# EAGLE design skema rangkaian (EAGLE 9.6.2)
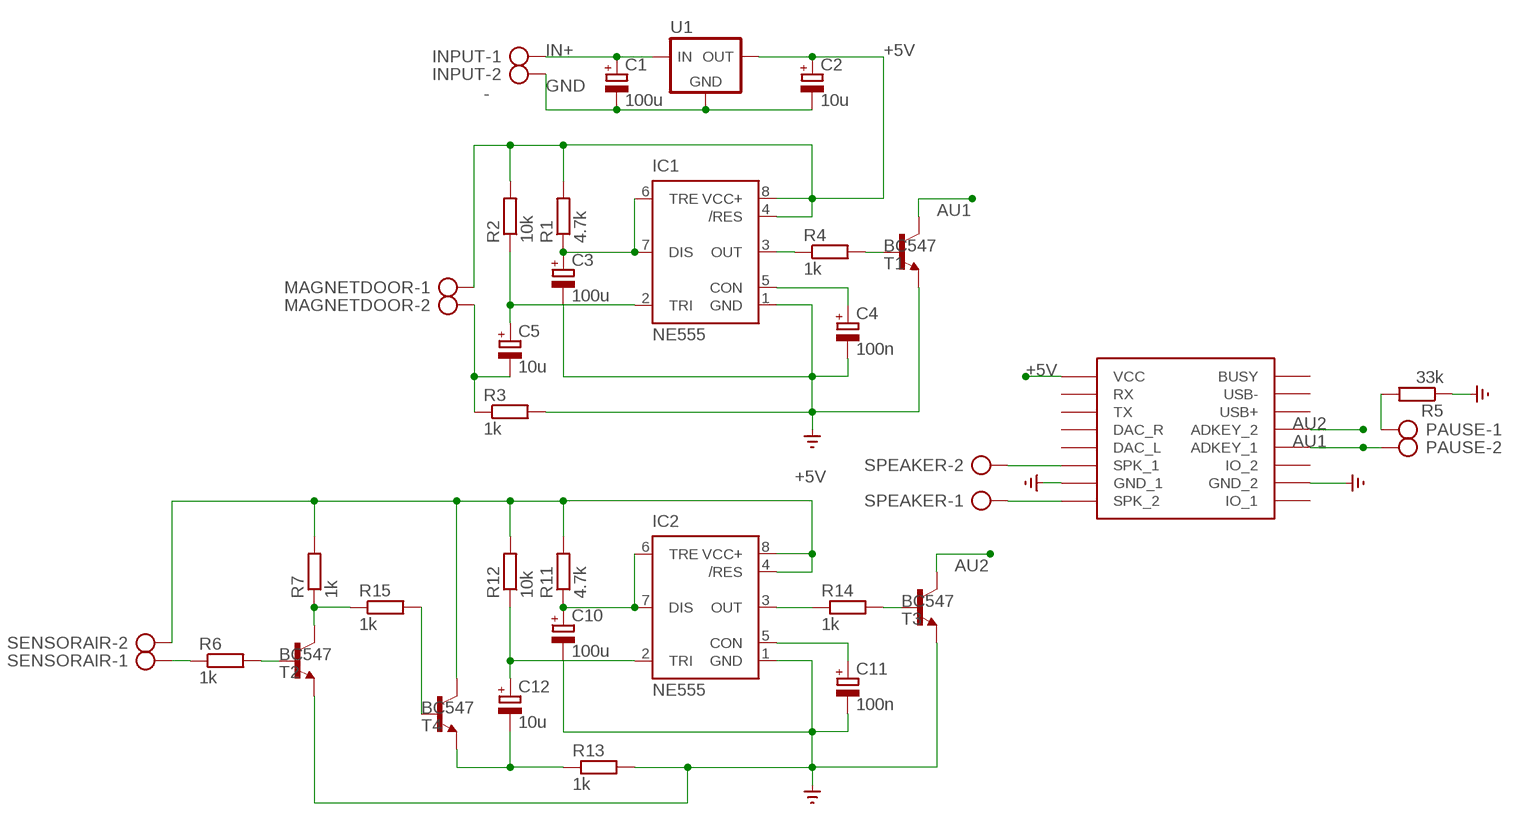
[diagram p0: schematic, sheet 1]

## Parts
C1  100u  CPOL-EUE2-5  [E2-5]
C2  10u  CPOL-EUE2-5  [E2-5]
C3  100u  CPOL-EUE2-5  [E2-5]
C4  100n  CPOL-EUE2-5  [E2-5]
C5  10u  CPOL-EUE2-5  [E2-5]
C10  100u  CPOL-EUE2-5  [E2-5]
C11  100n  CPOL-EUE2-5  [E2-5]
C12  10u  CPOL-EUE2-5  [E2-5]
IC1  NE555  [DIL-08]
IC2  NE555  [DIL-08]
INPUT  -  AK500/2-H  [AK500/2-H]
MAGNETDOOR  AK500/2-H  [AK500/2-H]
PAUSE  AK500/2-H  [AK500/2-H]
R1  4.7k  R-EU_0207/10  [0207/10]
R2  10k  R-EU_0207/10  [0207/10]
R3  1k  R-EU_0207/10  [0207/10]
R4  1k  R-EU_0207/10  [0207/10]
R5  33k  R-EU_0207/10  [0207/10]
R6  1k  R-EU_0207/10  [0207/10]
R7  1k  R-EU_0207/10  [0207/10]
R11  4.7k  R-EU_0207/10  [0207/10]
R12  10k  R-EU_0207/10  [0207/10]
R13  1k  R-EU_0207/10  [0207/10]
R14  1k  R-EU_0207/10  [0207/10]
R15  1k  R-EU_0207/10  [0207/10]
SENSORAIR  AK500/2-H  [AK500/2-H]
SPEAKER  AK500/2-H  [AK500/2-H]
T1  BC547  [TO92]
T2  BC547  [TO92]
T3  BC547  [TO92]
T4  BC547  [TO92]
U1  78XX-TO220V  [TO220BV]
U$1  DFPLAYER  [DFPLAYER]

## Nets
+5V: C2.+ IC1.4(/RES) IC1.8(VCC+) IC2.4(/RES) IC2.8(VCC+) MAGNETDOOR.1 R1.2 R2.2 R7.2 R11.2 R12.2 SENSORAIR.2 T4.3(C) U1.3(VOUT) U$1.VCC
AU1: PAUSE.2 T1.3(C) U$1.ADKEY1(ADKEY_1)
AU2: T3.3(C) U$1.ADKEY2(ADKEY_2)
GND: C1.- C2.- C3.- C4.- C10.- C11.- IC1.1(GND) IC2.1(GND) INPUT.2 R3.2 R5.1 R13.2 T1.1(E) T2.1(E) T3.1(E) U1.2(GND) U$1.GND_1 U$1.GND_2 ; supply symbol labelled SUPPLY0_GND_
IN+: C1.+ INPUT.1 U1.1(VIN)
N$1: R14.2 T3.2(B)
N$2: R6.2 T2.2(B)
N$3: C3.+ IC1.6(TRE) IC1.7(DIS) R1.1
N$4: C10.+ IC2.6(TRE) IC2.7(DIS) R11.1
N$5: C4.+ IC1.5(CON)
N$6: C5.+ IC1.2(TRI) R2.1
N$7: C5.- MAGNETDOOR.2 R3.1
N$8: IC1.3(OUT) R4.1
N$9: R4.2 T1.2(B)
N$10: PAUSE.1 R5.2
N$11: C11.+ IC2.5(CON)
N$12: C12.+ IC2.2(TRI) R12.1
N$13: C12.- R13.1 T4.1(E)
N$14: IC2.3(OUT) R14.1
N$15: SPEAKER.2 U$1.SPK1(SPK_1)
N$16: R6.1 SENSORAIR.1
N$17: R7.1 R15.1 T2.3(C)
N$18: R15.2 T4.2(B)
N$19: SPEAKER.1 U$1.SPK2(SPK_2)
Unconnected: U$1.BUSY U$1.DAC_L U$1.DAC_R U$1.IO1(IO_1) U$1.IO2(IO_2) U$1.RX U$1.TX U$1.USB+ U$1.USB-

## Library data of the parts
C1-C5 C10-C12 = rcl:CPOL-EU: POLARIZED CAPACITOR, European symbol; SPICEPREFIX: C
IC1 IC2 = st-microelectronics:NE555: General purpose bipolar Timer; MF: Arrow Electronics; MPN: NE555N; OC_FARNELL: 1467742; OC_NEWARK: 89K1486
INPUT MAGNETDOOR PAUSE SENSORAIR SPEAKER = con-ptr500:AK500/2-H: CONNECTOR Aug. 2004 / PTR Meßtechnik: Die Bezeichnung der Serie AK505 wurde geändert. Es handelt sich hierbei um AK500 in horizontaler Ausführung.; OC_FARNELL: unknown; OC_NEWARK: unknown
R1-R7 R11-R15 = rcl:R-EU_: RESISTOR, European symbol; SPICEPREFIX: R
T1-T4 = transistor:BC547: NPN TRANSISTOR
U1 = bt_regulator:78XX: 78XX Linear Voltage Regulator The venerable 7800-series Linear Voltage Regulator, including 7805, 7809, 7812, 7815, 7862 in 5 V, 6.2 V, 8.2 V, 9 V, 12 V, and 15 V, respectively Datasheets TI_LM78L05.pdf <http://www.ti.com/lit/ds/symlink/lm78l05.pdf> Fairchild_LM7805.pdf <https://www.fairchildsemi.com/datasheets/LM/LM7805.pdf>
U$1 = DFPlayer_v1:DFPLAYER

## Board
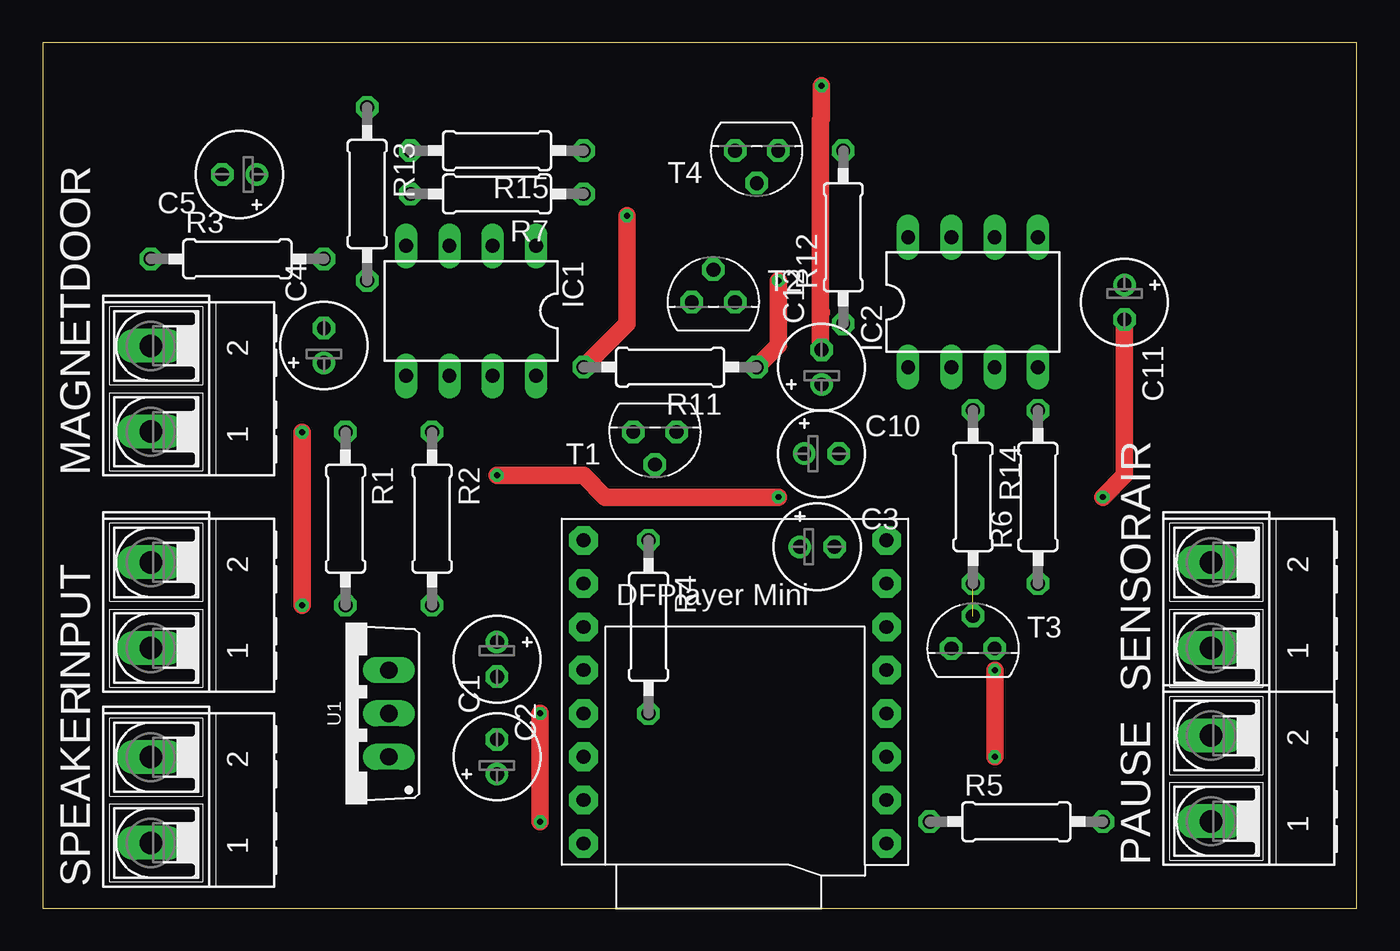
[diagram p1: board, top side]
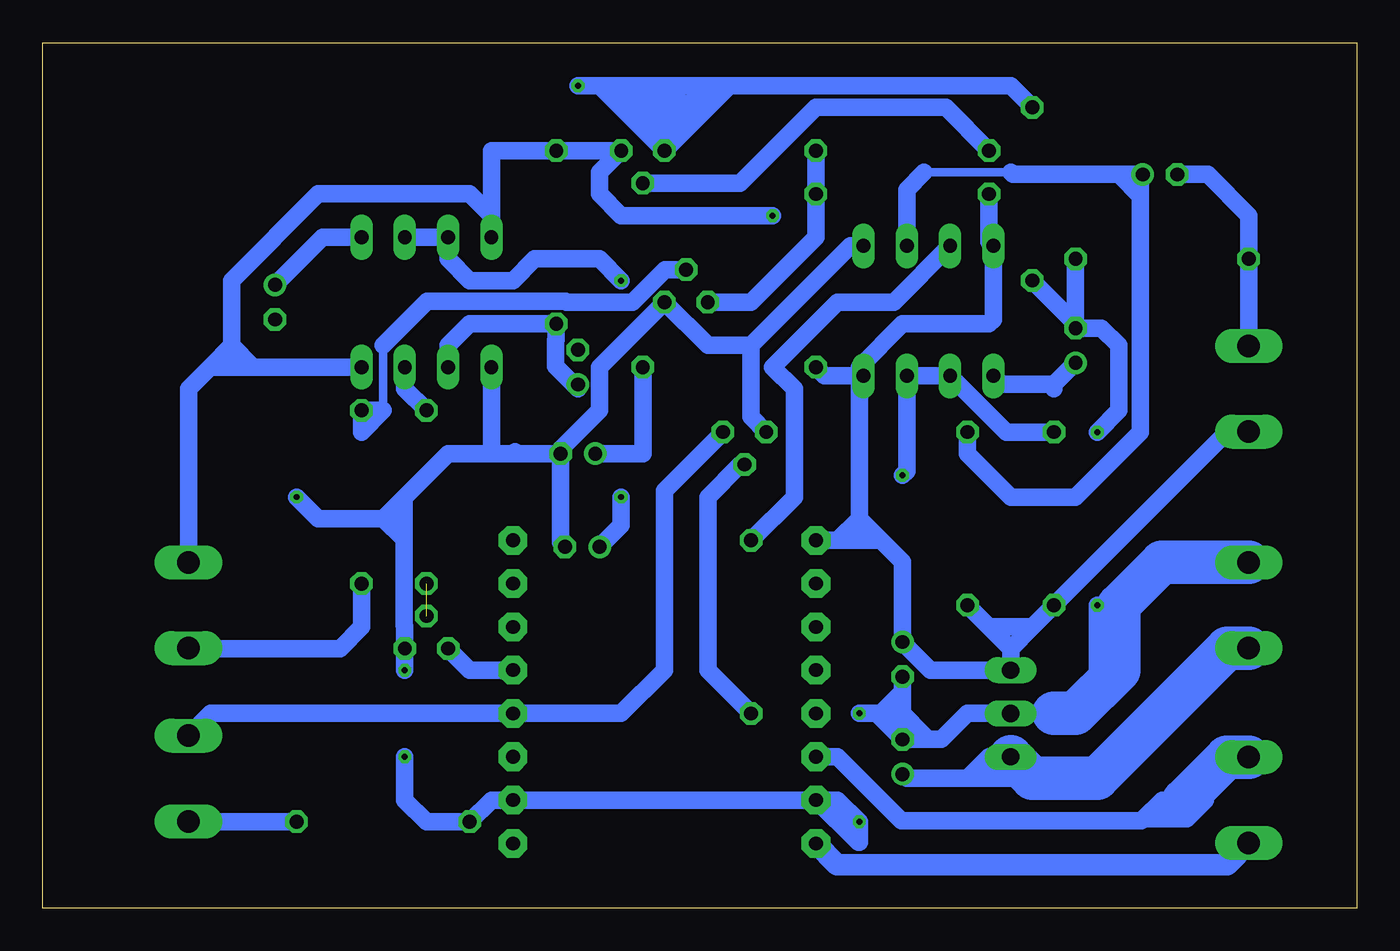
[diagram p2: board, bottom side, seen from below]

Size 77.14 x 50.79 mm. Coordinates in mm from the lower left corner, seen from the top.
Outline: 0,0 77.14,0 77.14,50.79 0,50.79 0,0
Copper layers (1*16): Top 0.035mm / dielectric 1.5mm / Bottom 0.035mm
Design rules "default": minimum track width 6mil, minimum drill 0.35mm, track to track 6mil, track to pad 6mil, pad to pad 6mil, via to via 6mil, smd to smd 6mil, copper to edge 40mil, drill to drill 6mil, minimum pad ring 10mil, minimum via ring 8mil, stop-mask expansion 4mil, vias tented up to drill 0mil, thermal gap 10mil

### Footprints (pad centres in the part's own frame; a part is rotated, then mirrored left to right if it is on the bottom)
E2-5 = drill 0.813 pad 1.27: + -1.016,0 | drill 0.813 pad 1.27 octagon: - 1.016,0
DIL-08 = drill 0.813 long: 1 -3.81,-3.81; 2 -1.27,-3.81; 3 1.27,-3.81; 4 3.81,-3.81; 5 3.81,3.81; 6 1.27,3.81; 7 -1.27,3.81; 8 -3.81,3.81
AK500/2-H = drill 1.321 long: 1 -2.515,0; 2 2.515,0
0207/10 = drill 0.813 octagon: 1 -5.08,0; 2 5.08,0
TO92 = drill 0.813 octagon: 1 1.27,0; 2 0,1.905; 3 -1.27,0
TO220BV = drill 1.016 long: 1 -2.54,0; 2 0,0; 3 2.54,0
DFPLAYER = drill 0.8 pad 1.676 octagon: ADKEY1 8.89,-1.27; ADKEY2 8.89,1.27; BUSY 8.89,8.89; DAC_L -8.89,-1.27; DAC_R -8.89,1.27; GND_1 -8.89,-6.35; GND_2 8.89,-6.35; IO1 8.89,-8.89; IO2 8.89,-3.81; RX -8.89,6.35; SPK1 -8.89,-3.81; SPK2 -8.89,-8.89; TX -8.89,3.81; USB+ 8.89,3.81; USB- 8.89,6.35; VCC -8.89,8.89

### Placement (x,y rotation side)
C1  26.67,8.89 90 top
C2  26.67,14.61 270 top
C3  45.47,21.21 0 top
C4  16.51,33.02 90 top
C5  11.56,43.05 180 top
C10  45.72,26.67 0 top
C11  63.5,35.56 270 top
C12  45.72,31.75 90 top
IC1  25.15,35.05 180 top
IC2  54.61,35.56 0 top
INPUT  6.35,17.78 90 top
MAGNETDOOR  6.35,30.48 90 top
PAUSE  68.58,7.62 90 top
R1  17.78,22.86 270 top
R2  22.86,22.86 270 top
R3  11.43,38.1 0 top
R4  35.56,16.51 270 top
R5  57.15,5.08 0 top
R6  58.42,24.13 90 top
R7  26.67,41.91 180 top
R11  36.83,31.75 180 top
R12  46.99,39.37 90 top
R13  19.05,41.91 270 top
R14  54.61,24.13 270 top
R15  26.67,44.45 180 top
SENSORAIR  68.58,17.78 90 top
SPEAKER  6.35,6.35 90 top
T1  35.94,27.94 180 top
T2  39.37,35.56 0 top
T3  54.61,15.24 0 top
T4  41.91,44.45 180 top
U1  20.32,11.43 90 top
U$1  40.64,12.7 0 top

### Tracks (layer width: path | path; a pad name or v marks a point on that pad's centre or on a via)
+5V  (via drill 0.35)
  Top 1.016: v34.29,40.64 34.29,34.29 R11.2
  Bottom 1.016: 27.94,21.59 26.67,20.32 C2.+ 25.02,13.97 U1.3 20.32,15.24 | 27.94,21.59 29.21,21.59 | 29.21,21.59 30.48,21.59 | 30.48,21.59 U$1.VCC | 20.32,15.24 21.59,16.51 | 21.59,16.51 R2.2 | 20.32,15.24 19.05,16.51 | 19.05,16.51 R1.2 7.59,27.96 MAGNETDOOR.1 | IC1.8 29.21,30.99 29.21,22.86 | 29.21,22.86 29.21,21.59 | IC1.8 29.21,31.5 29.21,31.75 26.67,34.29 21.59,34.29 21.34,34.54 IC1.4 21.59,39.12 R7.2 | R11.2 31.24,31.24 IC1.8 | 66.04,31.75 64.77,31.75 | 64.77,31.75 IC2.4 | SENSORAIR.2 68.58,30.48 67.31,31.75 | 67.31,31.75 66.04,31.75 | v34.29,40.64 43.18,40.64 44.45,41.91 44.45,43.18 T4.3 R12.2 50.8,44.45 IC2.8 50.8,40.64 52.07,41.91 60.96,41.91 66.04,36.83 66.04,33.02 | 66.04,33.02 66.04,31.75 | 67.31,31.75 66.04,33.02 | 64.77,31.75 66.04,33.02 | 27.94,21.59 29.21,22.86 | 29.21,22.86 30.48,21.59 | 19.05,16.51 21.59,16.51
AU1
  Bottom 1.016: PAUSE.2 67.28,11.43 U$1.ADKEY1 43.18,11.43 40.64,13.97 40.64,24.51 T1.3
AU2
  Bottom 1.016: T3.3 52.07,13.97 U$1.ADKEY2
GND  (via drill 0.35)
  Top 1.016: v55.88,8.89 v55.88,13.97 | C11.- 63.5,25.4 v62.23,24.13 | v15.24,27.94 v15.24,17.78 | v29.21,11.43 v29.21,5.08
  Bottom 1.016: 25.4,9.91 24.38,9.91 22.86,11.43 U1.2 16.51,11.43 15.24,12.7 v15.24,17.78 13.97,17.78 | 25.4,9.91 C1.- | C1.- 26.67,11.43 | 26.67,12.7 C2.- | R3.2 C4.- | v55.88,8.89 55.88,6.35 54.61,5.08 R5.1 50.8,6.35 U$1.GND_2 U$1.GND_1 | C10.- 49.53,26.67 | 49.53,26.67 50.8,26.67 | 50.8,26.67 53.34,26.67 55.93,24.08 | 55.93,24.08 55.93,22.86 | 55.93,22.86 55.93,21.64 | 55.93,21.64 55.93,16.6 55.88,16.55 T3.1 v55.88,13.97 | C4.- 16.51,34.29 R13.2 | IC1.1 29.72,38.86 35.56,33.02 | 35.56,33.02 35.56,28.83 T1.1 | 35.56,33.02 38.1,33.02 T2.1 44.45,31.75 44.45,29.21 46.74,26.92 C10.- | C10.- 46.74,21.46 C3.- | v62.23,24.13 60.96,22.86 57.15,22.86 | 57.15,22.86 55.93,22.86 | C4.- 14.99,34.04 13.97,33.02 13.97,29.21 v15.24,27.94 | 55.93,21.64 57.15,22.86 | 57.15,22.86 55.93,24.08 | 50.8,30.73 IC2.1 50.8,26.67 | 49.53,26.67 49.4,26.8 | 25.4,9.91 25.4,10.16 26.67,11.43 | C1.- 27.43,10.67 | 27.43,10.67 28.19,11.43 | v29.21,11.43 28.19,11.43 | U$1.GND_1 29.26,3.86 | 29.26,3.86 29.21,3.86 | 29.26,3.86 29.21,3.91 v29.21,5.08 30.48,6.35 U$1.GND_1 | 28.19,11.43 27.94,11.43 26.67,12.7 | 26.67,12.7 26.67,11.43 | 26.67,11.43 27.43,10.67
  Bottom 2.54: INPUT.2 11.46,20.29 13.97,17.78 13.97,13.97 16.51,11.43 17.78,11.43
IN+
  Bottom 1.016: 22.86,7.62 21.59,8.89 U1.1 21.59,7.62 | 22.86,7.62 26.42,7.62 C1.+ | 19.05,7.62 22.86,7.62
  Bottom 2.54: U1.1 19.05,7.62 15.24,7.62 7.59,15.26 INPUT.1
N$1  (1 unrouted)
N$2
  Bottom 0.508: 57.15,29.21 57.15,33.02
  Bottom 1.016: T2.2 40.6,37.47 41.57,36.49 41.96,36.11 42.51,35.56 46.39,35.56 46.44,35.61 54.56,35.61 57.15,33.02 | R6.2 57.15,29.21 58.42,27.94 R6.2
N$3  (via drill 0.35)
  Top 1.016: v26.67,25.4 31.75,25.4 33.02,24.13 v43.18,24.13
  Bottom 1.016: R1.1 20.57,27.94 IC1.6 IC1.7 26.42,25.65 v26.67,25.4 | C3.+ 43.18,22.48 v43.18,24.13
N$4  (via drill 0.35)
  Top 1.016: R11.1 43.18,33.02 v43.18,36.83
  Bottom 1.016: IC2.6 IC2.7 53.34,38.1 52.07,36.83 49.53,36.83 48.26,38.1 44.45,38.1 v43.18,36.83 | C10.+ 41.91,26.67 R11.1
N$5
  Bottom 1.016: C4.+ 17.78,30.73 | 17.78,30.73 17.78,30.48 | 17.78,30.73 20.83,30.73 IC1.5
N$6
  Bottom 0.508: 25.4,43.18 20.32,43.18 12.7,43.18 C5.+
  Bottom 1.016: R2.1 22.86,26.67 20.32,24.13 16.51,24.13 12.7,27.94 12.7,40.64 12.7,41.78 | 12.7,41.78 12.7,42.93 C5.+ 13.97,43.05 | IC1.2 26.42,42.16 25.4,43.18 | 13.97,43.05 20.19,43.05 20.32,43.18 | 12.7,41.78 13.97,43.05
N$7
  Bottom 1.016: MAGNETDOOR.2 R3.1 6.35,40.64 8.76,43.05 C5.-
N$8
  Bottom 1.016: R4.1 33.02,24.13 33.02,30.48 34.29,31.75 30.48,35.56 27.18,35.56 IC1.3
N$9
  Bottom 1.016: T1.2 36.2,26.04 38.1,24.13 38.1,13.97 R4.2
N$10
  Bottom 1.016: R5.2 68.55,5.08 PAUSE.1
N$11
  Bottom 1.016: IC2.5 60.71,39.37 C11.+
N$12
  Bottom 1.016: IC2.2 53.34,33.02 52.07,34.29 R12.1 46.99,33.36 47.04,33.31 47.04,31.8 45.72,30.48 C12.+
N$13  (via drill 0.35)
  Top 1.016: v45.72,48.26 45.72,46.32 45.67,46.27 45.67,35.01 | 45.67,35.01 45.72,34.96 | 45.67,35.01 45.67,32.82 C12.-
  Bottom 1.016: T4.1 36.83,48.26 | 36.83,48.26 20.32,48.26 R13.1 | T4.1 40.64,45.72 | 40.64,45.72 43.18,48.26 | 43.18,48.26 44.45,48.26 | 44.45,48.26 v45.72,48.26 | 36.83,48.26 38.1,48.26 | 38.1,48.26 40.64,48.26 | 43.18,48.26 41.91,48.26 | 38.1,48.26 39.37,46.99 | 39.37,46.99 40,46.36 | 40,46.36 40.64,45.72 | 40,46.36 41.91,48.26 | 41.91,48.26 40.64,48.26 | 40.64,48.26 39.37,46.99 | T4.1 44.45,48.26
N$14
  Bottom 1.016: R14.1 55.88,30.48 IC2.3
N$15
  Bottom 1.016: 12.52,5.26 11.43,6.35 10.16,6.35 8.89,6.35 9.98,5.26 12.52,5.26 | 12.52,5.26 12.65,5.13 26.72,5.13 30.48,8.89 U$1.SPK1
  Bottom 2.54: SPEAKER.2 7.64,8.87 10.16,6.35
N$16
  Bottom 1.016: SENSORAIR.1 68.55,15.24 59.69,15.24 58.42,16.51 R6.1
N$17
  Bottom 1.016: R15.1 R7.1 31.75,39.37 35.56,35.56 T2.3
N$18
  Bottom 1.016: R15.2 24.13,46.99 31.75,46.99 36.2,42.55 T4.2
N$19
  Bottom 1.27: SPEAKER.1 7.62,2.56 30.5,2.56 U$1.SPK2